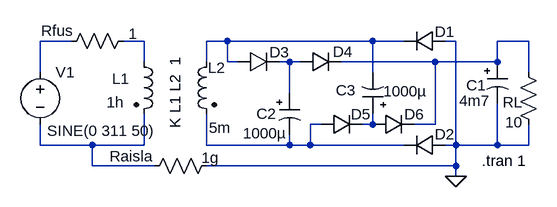
[diagram p0: schematic BoostRect_Simple.asc]
BoostRect_Simple.asc, the LTspice schematic file:
Version 4
SHEET 1 880 680
WIRE -272 112 -320 112
WIRE -160 112 -192 112
WIRE -32 112 -64 112
WIRE 192 112 -32 112
WIRE 240 112 192 112
WIRE 320 112 304 112
WIRE 432 112 384 112
WIRE -160 144 -160 112
WIRE -64 144 -64 112
WIRE -32 144 -32 112
WIRE -16 144 -32 144
WIRE 64 144 48 144
WIRE 80 144 64 144
WIRE 288 144 144 144
WIRE 384 144 384 112
WIRE 384 144 288 144
WIRE -320 160 -320 112
WIRE 192 160 192 112
WIRE 432 160 432 112
WIRE 64 192 64 144
WIRE 112 240 96 240
WIRE 192 240 192 224
WIRE 192 240 176 240
WIRE 288 240 288 144
WIRE 288 240 256 240
WIRE -320 272 -320 240
WIRE -240 272 -320 272
WIRE -160 272 -160 224
WIRE -160 272 -240 272
WIRE -64 272 -64 224
WIRE 64 272 64 256
WIRE 64 272 -64 272
WIRE 96 272 96 240
WIRE 96 272 64 272
WIRE 240 272 96 272
WIRE 320 272 320 112
WIRE 320 272 304 272
WIRE 384 272 384 208
WIRE 384 272 320 272
WIRE 432 272 432 240
WIRE 432 272 384 272
WIRE -240 304 -240 272
WIRE -144 304 -240 304
WIRE 320 304 320 272
WIRE 320 304 -64 304
WIRE 320 320 320 304
FLAG 320 320 0
SYMBOL res -176 96 R90
WINDOW 0 16 118 VBottom 0
WINDOW 3 -11 1 VTop 0
SYMATTR InstName Rfus
SYMATTR Value 1
SYMATTR SpiceLine tol=1 pwr=0.1
SYMBOL voltage -320 144 R0
WINDOW 3 11 106 Left 0
WINDOW 123 0 0 Left 0
WINDOW 39 0 0 Left 0
SYMATTR Value SINE(0 311 50)
SYMATTR InstName V1
SYMBOL diode 304 128 M270
WINDOW 0 15 1 VTop 0
WINDOW 3 0 32 Invisible 0
SYMATTR InstName D1
SYMATTR Value MURS320
SYMBOL diode 304 288 M270
WINDOW 0 17 1 VTop 0
WINDOW 3 0 32 Invisible 0
SYMATTR InstName D2
SYMATTR Value MURS320
SYMBOL polcap 368 144 R0
WINDOW 0 -32 36 Left 0
WINDOW 3 -43 60 Left 0
SYMATTR InstName C1
SYMATTR Value 4m7
SYMATTR Description Capacitor
SYMATTR Type cap
SYMATTR SpiceLine V=25 Irms=3 Rser=0.017 Lser=0 mfg="Panasonic" pn="ECA1EFQ472" type="Al electrolytic"
SYMBOL res -160 320 R270
WINDOW 0 15 -20 VTop 0
WINDOW 3 44 102 VBottom 0
SYMATTR InstName Raisla
SYMATTR Value 1g
SYMATTR SpiceLine tol=1 pwr=0.1
SYMBOL res 416 144 R0
WINDOW 0 -24 62 Left 0
WINDOW 3 -20 93 Left 0
SYMATTR InstName RL
SYMATTR Value 10
SYMATTR SpiceLine tol=1 pwr=0.1
SYMBOL ind2 -176 128 R0
WINDOW 0 -33 42 Left 0
WINDOW 3 -42 78 Left 0
SYMATTR InstName L1
SYMATTR Value 1h
SYMATTR SpiceLine Rser=1
SYMBOL ind2 -48 128 M0
WINDOW 0 -13 25 Left 0
WINDOW 3 -22 117 Left 0
SYMATTR InstName L2
SYMATTR Value 5m
SYMATTR SpiceLine Rser=.01
SYMBOL diode -16 160 R270
WINDOW 0 15 64 VTop 0
WINDOW 3 0 32 Invisible 0
SYMATTR InstName D3
SYMATTR Value MURS320
SYMBOL diode 80 160 R270
WINDOW 0 16 66 VTop 0
WINDOW 3 0 32 Invisible 0
SYMATTR InstName D4
SYMATTR Value MURS320
SYMBOL polcap 48 192 R0
WINDOW 3 -56 62 Left 0
WINDOW 0 -35 32 Left 0
SYMATTR Value 1000µ
SYMATTR InstName C2
SYMATTR Description Capacitor
SYMATTR Type cap
SYMATTR SpiceLine V=35 Irms=1.98 Rser=0.029 Lser=0 mfg="Nichicon" pn="UPL1V102MRH" type="Al electrolytic"
SYMBOL polcap 208 224 R180
WINDOW 0 42 36 Left 0
WINDOW 3 -68 35 Left 0
SYMATTR InstName C3
SYMATTR Value 1000µ
SYMATTR Description Capacitor
SYMATTR Type cap
SYMATTR SpiceLine V=50 Irms=1.11 Rser=0.053 Lser=0 mfg="Nichicon" pn="UPR1H102MRH" type="Al electrolytic"
SYMBOL diode 192 256 R270
WINDOW 0 16 64 VTop 0
WINDOW 3 0 32 Invisible 0
SYMATTR InstName D6
SYMATTR Value MURS320
SYMBOL diode 112 256 R270
WINDOW 0 16 62 VTop 0
WINDOW 3 0 32 Invisible 0
SYMATTR InstName D5
SYMATTR Value MURS320
TEXT 360 296 Left 0 !.tran 1
TEXT -112 136 VRight 0 !K L1 L2  1

The netlist it stands for:
* BoostRect_Simple.asc
Rfus N002 N001 1 tol=1 pwr=0.1
V1 N001 N008 SINE(0 311 50)
D1 0 N003 MURS320
D2 0 N006 MURS320
C1 N004 0 4m7 V=25 Irms=3 Rser=0.017 Lser=0 mfg="Panasonic" pn="ECA1EFQ472" type="Al electrolytic"
Raisla N008 0 1g tol=1 pwr=0.1
RL N004 0 10 tol=1 pwr=0.1
L1 N002 N008 1h Rser=1
L2 N003 N006 5m Rser=.01
D3 N003 N005 MURS320
D4 N005 N004 MURS320
C2 N005 N006 1000µ V=35 Irms=1.98 Rser=0.029 Lser=0 mfg="Nichicon" pn="UPL1V102MRH" type="Al electrolytic"
C3 N007 N003 1000µ V=50 Irms=1.11 Rser=0.053 Lser=0 mfg="Nichicon" pn="UPR1H102MRH" type="Al electrolytic"
D6 N007 N004 MURS320
D5 N006 N007 MURS320
.model D D
.lib standard.dio
.tran 1
K L1 L2  1
.backanno
.end